# EasyEDA Pro project ProPrj_数控直流电源v3_2025-11-28.epro, schematic v3
Board Name: Board1; Create Date: 2025-11-23; Page Name: P1; Project Name: 数控直流电源v3; Schematic Name: v3; Update Date: 2025-11-23; Company: 嘉立创EDA; Page Size: A4; Version: V1.0
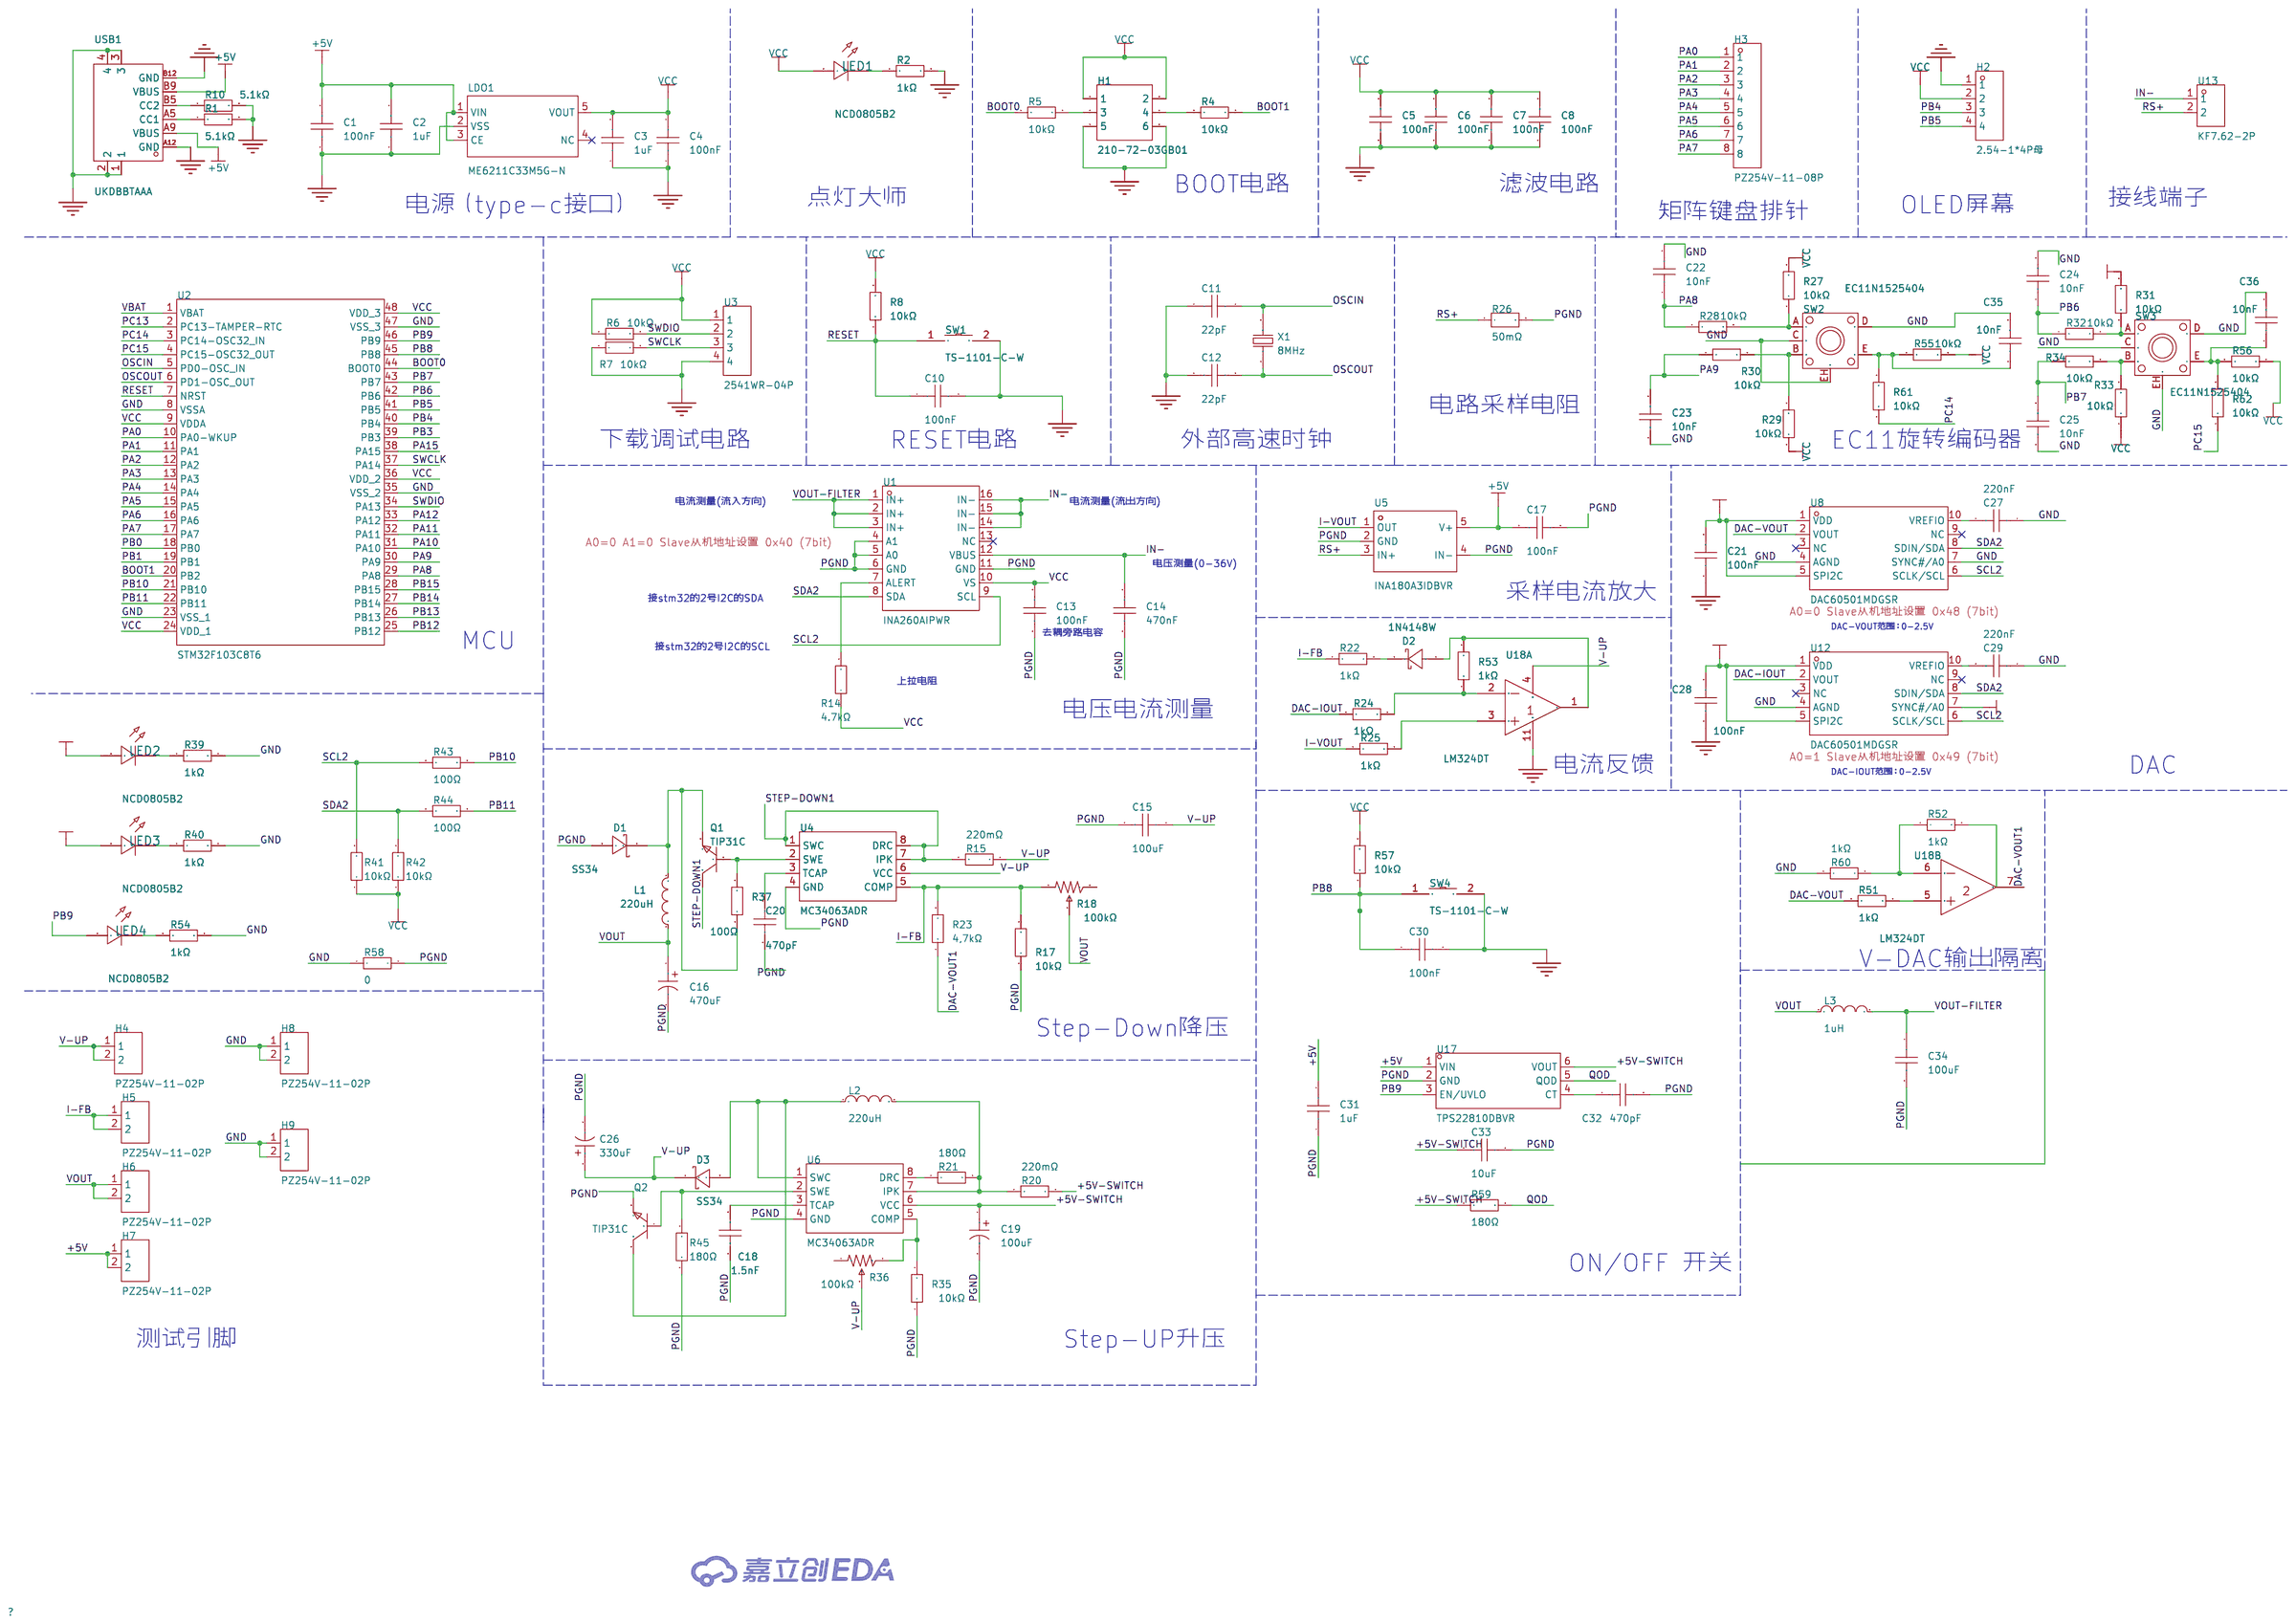
[diagram p0: schematic sheet]

## Parts
C1  100nF  [C0805]
C2  1uF  [C0805]
C3  1uF  [C0805]
C4  100nF  [C0805]
C5  100nF  [C0805]
C6  100nF  [C0805]
C7  100nF  [C0805]
C8  100nF  [C0805]
C10  100nF  [C0805]
C11  22pF  [C0805]
C12  22pF  [C0805]
C13  100nF  [C0805]
C14  470nF  [C0805]
C15  100uF  [CAP-SMD_BD6.3-L6.6-W6.6-RD]
C16  470uF  [CAP-SMD_BD8.0-L8.3-W8.3-LS9.0-FD_H10.5]
C17  100nF  [C0805]
C18  1.5nF  [C0805]
C19  100uF  [CAP-SMD_BD6.3-L6.6-W6.6-RD]
C20  470pF  [C0805]
C21  100nF  [C0805]
C22  10nF  [C0805]
C23  10nF  [C0805]
C24  10nF  [C0805]
C25  10nF  [C0805]
C26  330uF  [CAP-SMD_BD10.0-L10.3-W10.3-FD-LS11.0_H12.0]
C27  220nF  [C0805]
C28  100nF  [C0805]
C29  220nF  [C0805]
C30  100nF  [C0805]
C31  1uF  [C0805]
C32  470pF  [C0805]
C33  10uF  [C0805]
C34  100uF  [CAP-SMD_BD6.3-L6.6-W6.6-RD]
C35  10nF  [C0805]
C36  10nF  [C0805]
D1  SS34  [SMA_L4.3-W2.6-LS5.0-FD]
D2  1N4148W  [SOD-123_L2.7-W1.6-LS3.7-FD]
D3  SS34  [SMA_L4.3-W2.6-LS5.0-FD]
H1  210-72-03GB01  [HDR-TH_6P-P2.54-V-R2-C3-S2.54_A2541WV-2X3P]
H2  2.54-1*4P母  [HDR-TH_4P-P2.54-V-F]
H3  PZ254V-11-08P  [HDR-TH_8P-P2.54-V-M]
H4  PZ254V-11-02P  [HDR-TH_2P-P2.54-V-M]
H5  PZ254V-11-02P  [HDR-TH_2P-P2.54-V-M]
H6  PZ254V-11-02P  [HDR-TH_2P-P2.54-V-M]
H7  PZ254V-11-02P  [HDR-TH_2P-P2.54-V-M]
H8  PZ254V-11-02P  [HDR-TH_2P-P2.54-V-M]
H9  PZ254V-11-02P  [HDR-TH_2P-P2.54-V-M]
L1  220uH  [IND-SMD_L12.3-W12.3_SMDRI127]
L2  220uH  [IND-SMD_L12.3-W12.3_SMDRI127]
L3  1uH  [IND-SMD_L7.0-W6.6]
LDO1  ME6211C33M5G-N  [SOT-23-5_L3.0-W1.7-P0.95-LS2.8-BL]
LED1  NCD0805B2  [LED0805-R-RD]
LED2  NCD0805B2  [LED0805-R-RD]
LED3  NCD0805B2  [LED0805-R-RD]
LED4  NCD0805B2  [LED0805-R-RD]
Q1  TIP31C  [TO-220-3_L10.0-W4.5-P2.54-L]
Q2  TIP31C  [TO-220-3_L10.0-W4.5-P2.54-L]
R1  5.1kΩ  [R0805]
R2  1kΩ  [R0805]
R4  10kΩ  [R0805]
R5  10kΩ  [R0805]
R6  10kΩ  [R0805]
R7  10kΩ  [R0805]
R8  10kΩ  [R0805]
R10  5.1kΩ  [R0805]
R14  4.7kΩ  [R0805]
R15  220mΩ  [R1206]
R17  10kΩ  [R0805]
R18  100kΩ  [RES-ADJ-TH_3296W]
R20  220mΩ  [R1206]
R21  180Ω  [R0805]
R22  1kΩ  [R0805]
R23  4,7kΩ  [R0805]
R24  1kΩ  [R0805]
R25  1kΩ  [R0805]
R26  50mΩ  [R1206]
R27  10kΩ  [R0805]
R28  10kΩ  [R0805]
R29  10kΩ  [R0805]
R30  10kΩ  [R0805]
R31  10kΩ  [R0805]
R32  10kΩ  [R0805]
R33  10kΩ  [R0805]
R34  10kΩ  [R0805]
R35  10kΩ  [R0805]
R36  100kΩ  [RES-ADJ-TH_3296W-1-203]
R37  100Ω  [R0805]
R39  1kΩ  [R0805]
R40  1kΩ  [R0805]
R41  10kΩ  [R0805]
R42  10kΩ  [R0805]
R43  100Ω  [R0805]
R44  100Ω  [R0805]
R45  180Ω  [R0805]
R51  1kΩ  [R0805]
R52  1kΩ  [R0805]
R53  1kΩ  [R0805]
R54  1kΩ  [R0805]
R55  10kΩ  [R0805]
R56  10kΩ  [R0805]
R57  10kΩ  [R0805]
R58  0  [R0805]
R59  180Ω  [R0805]
R60  1kΩ  [R0805]
R61  10kΩ  [R0805]
R62  10kΩ  [R0805]
SW1  TS-1101-C-W  [SW-SMD_L6.0-W3.3-LS8.0]
SW2  EC11N1525404  [SW-TH_EC11NXXXX]
SW3  EC11N1525404  [SW-TH_EC11NXXXX]
SW4  TS-1101-C-W  [SW-SMD_L6.0-W3.3-LS8.0]
U1  INA260AIPWR  [TSSOP-16_L5.0-W4.4-P0.65-LS6.4-BL-1]
U2  STM32F103C8T6  [LQFP-48_L7.0-W7.0-P0.50-LS9.0-BL]
U3  2541WR-04P  [HDR-TH_4P-P2.54-H-M-W10.4-N]
U4  MC34063ADR  [SOIC-8_L4.9-W3.9-P1.27-LS6.0-BL]
U5  INA180A3IDBVR  [SOT-23-5_L3.0-W1.7-P0.95-LS2.8-BR]
U6  MC34063ADR  [SOIC-8_L4.9-W3.9-P1.27-LS6.0-BL]
U8  DAC60501MDGSR  [VSSOP-10_L3.0-W3.0-P0.50-LS4.9-BL]
U12  DAC60501MDGSR  [VSSOP-10_L3.0-W3.0-P0.50-LS4.9-BL]
U13  KF7.62-2P  [CONN-TH_KF7.62-2P]
U17  TPS22810DBVR  [SOT-23-6_L2.9-W1.6-P0.95-LS2.8-BL]
U18  LM324DT  [SOIC-14_L8.7-W3.9-P1.27-LS6.0-BL]  (sections 1,2)
USB1  UKDBBTAAA  [USB-C-SMD]
X1  8MHz  [CRYSTAL-TH_L11.1-W4.7-P4.88]

## Library data of the parts
C1 C4-C8 C10 C13 C17 C21 C28 C30 = 0805B104K500NT: 容值:100nF;精度:±10%;额定电压:50V;温度系数:X7R;; LCSC Part Name: 100nF ±10% 50V; Supplier Part: C38141; Manufacturer: FH(风华); Supplier Footprint: 0805; JLCPCB Part Class: Extended Part; Datasheet: https://item.szlcsc.com/datasheet/0805B104K500NT/39123.html; Supplier: LCSC; Tolerance: ±10%; Voltage Rating: 50V; Temperature Coefficient: X7R
C2 C3 C31 = CL21B105KBFNNNE: 容值:1uF;精度:±10%;额定电压:50V;温度系数:X7R;; LCSC Part Name: 1uF ±10% 50V; Supplier Part: C28323; Manufacturer: SAMSUNG(三星); Supplier Footprint: 0805; JLCPCB Part Class: Basic Part; Datasheet: https://item.szlcsc.com/datasheet/CL21B105KBFNNNE/29074.html; Supplier: LCSC; Tolerance: ±10%; Voltage Rating: 50V; Temperature Coefficient: X7R
C11 C12 = 0805CG220J500NT: 容值:22pF;精度:±5%;额定电压:50V;温度系数:C0G;; LCSC Part Name: 22pF ±5% 50V; Supplier Part: C24658; Manufacturer: FH(风华); Supplier Footprint: 0805; JLCPCB Part Class: Extended Part; Datasheet: https://item.szlcsc.com/datasheet/0805CG220J500NT/25399.html; Supplier: LCSC; Tolerance: ±5%; Voltage Rating: 50V; Temperature Coefficient: C0G
C14 = 0805B474K500NT: 容值:470nF;精度:±10%;额定电压:50V;温度系数:X7R;; LCSC Part Name: 470nF ±10% 50V; Supplier Part: C49955; Manufacturer: FH(风华); Supplier Footprint: 0805; JLCPCB Part Class: Extended Part; Datasheet: https://item.szlcsc.com/datasheet/0805B474K500NT/50964.html; Supplier: LCSC; Tolerance: ±10%; Voltage Rating: 50V; Temperature Coefficient: X7R
C15 C19 C34 = MA35V100M6X8: 容值:100uF;精度:±20%;额定电压:35V;纹波电流:2.9A@100kHz;等效串联电阻(ESR):30mΩ@100kHz;类型:聚合物;; LCSC Part Name: 100uF ±20% 35V; Supplier Part: C46550467; Manufacturer: JIERR(捷而瑞); Supplier Footprint: SMD,D6.3xL7.7mm; JLCPCB Part Class: Extended Part; Datasheet: https://item.szlcsc.com/datasheet/MA35V100M6X8/48680161.html; Supplier: LCSC; Tolerance: ±20%; Voltage Rating: 35V; Ripple Current: 2.9A@100kHz; Equivalent Series Resistance(ESR): 30mΩ@100kHz; Type: 聚合物; Diameter: 6.3mm; Height - Seated (Max): 7mm; Lifetime: 2000hrs@105℃; Operating Temperature: -55℃~+105℃
C16 = MA25V470M8x10: 容值:470uF;精度:±20%;额定电压:25V;纹波电流:4.1A@100kHz;等效串联电阻(ESR):25mΩ@100kHz;类型:聚合物;; LCSC Part Name: 470uF ±20% 25V; Supplier Part: C46550466; Manufacturer: JIERR(捷而瑞); Supplier Footprint: SMD,D8xL10mm; JLCPCB Part Class: Extended Part; Datasheet: https://item.szlcsc.com/datasheet/MA25V470M8x10/48680160.html; Supplier: LCSC; Tolerance: ±20%; Voltage Rating: 25V; Ripple Current: 4.1A@100kHz; Equivalent Series Resistance(ESR): 25mΩ@100kHz; Type: 聚合物; Diameter: 8mm; Height - Seated (Max): 10mm; Lifetime: 2000hrs@105℃; Operating Temperature: -55℃~+105℃
C18 = 0805B152K500NT: 容值:1.5nF;精度:±10%;额定电压:50V;温度系数:X7R;; LCSC Part Name: 1.5nF ±10% 50V; Supplier Part: C1717; Manufacturer: FH(风华); Supplier Footprint: 0805; JLCPCB Part Class: Extended Part; Datasheet: https://atta.szlcsc.com/upload/public/pdf/source/20200305/C486355_26A10D38EF8C2A5C37091D0039909270.pdf; Supplier: LCSC; Tolerance: ±10%; Voltage Rating: 50V; Temperature Coefficient: X7R
C20 C32 = 0805B471K500NT: 容值:470pF;精度:±10%;额定电压:50V;温度系数:X7R;; LCSC Part Name: 470pF ±10% 50V; Supplier Part: C1743; Manufacturer: FH(风华); Supplier Footprint: 0805; JLCPCB Part Class: Basic Part; Datasheet: https://item.szlcsc.com/datasheet/0805B471K500NT/2095.html; Supplier: LCSC; Tolerance: ±10%; Voltage Rating: 50V; Temperature Coefficient: X7R
C22-C25 C35 C36 = 0805B103K500NT_C52278: 容值:10nF;精度:±10%;额定电压:50V;材质(温度系数):X7R;; LCSC Part Name: 10nF ±10% 50V; Supplier Part: C52278; Manufacturer: FH(风华); Manufacturer Part: 0805B103K500NT; Supplier Footprint: 0805; JLCPCB Part Class: Extended Part; Datasheet: https://atta.szlcsc.com/upload/public/pdf/source/20200305/C486355_26A10D38EF8C2A5C37091D0039909270.pdf; Supplier: LCSC; Tolerance: ±10%; Voltage Rated: 50V; Temperature Coefficient: X7R
C26 = MA35V330M10x10: 容值:330uF;精度:±20%;额定电压:35V;纹波电流:3.5A@100kHz;等效串联电阻(ESR):25mΩ@100kHz;类型:聚合物;; LCSC Part Name: 330uF ±20% 35V; Supplier Part: C46550470; Manufacturer: JIERR(捷而瑞); Supplier Footprint: SMD,D10xL10mm; JLCPCB Part Class: Extended Part; Datasheet: https://item.szlcsc.com/datasheet/MA35V330M10x10/48680164.html; Supplier: LCSC; Tolerance: ±20%; Voltage Rating: 35V; Ripple Current: 3.5A@100kHz; Equivalent Series Resistance(ESR): 25mΩ@100kHz; Type: 聚合物; Diameter: 10mm; Height - Seated (Max): 10mm; Lifetime: 2000hrs@105℃; Operating Temperature: -55℃~+105℃
C27 C29 = 0805B224K500NT: 容值:220nF;精度:±10%;额定电压:50V;温度系数:X7R;; LCSC Part Name: 220nF ±10% 50V; Supplier Part: C163697; Manufacturer: FH(风华); Supplier Footprint: 0805; JLCPCB Part Class: Extended Part; Datasheet: https://atta.szlcsc.com/upload/public/pdf/source/20200305/C486355_26A10D38EF8C2A5C37091D0039909270.pdf; Supplier: LCSC; Tolerance: ±10%; Voltage Rating: 50V; Temperature Coefficient: X7R
C33 = CL21A106KAYNNNE_C15850: 容值:10uF;精度:±10%;额定电压:25V;温度系数:X5R;; LCSC Part Name: 10uF ±10% 25V; Supplier Part: C15850; Manufacturer: SAMSUNG(三星); Manufacturer Part: CL21A106KAYNNNE; Supplier Footprint: 0805; JLCPCB Part Class: Basic Part; Datasheet: https://item.szlcsc.com/datasheet/CL21A106KAYNNNE/16532.html; Supplier: LCSC; Tolerance: ±10%; Voltage Rating: 25V; Temperature Coefficient: X5R
D1 D3 = SS34_C7420365: 二极管配置:独立式;正向压降(Vf):550mV@3.0A;直流反向耐压(Vr):40V;整流电流:3A;; LCSC Part Name: 电压:40V 电流:3A; Supplier Part: C7420365; Manufacturer: R+O(宏嘉诚); Supplier Footprint: SMA(DO-214AC); JLCPCB Part Class: Extended Part; Datasheet: https://item.szlcsc.com/datasheet/SS34/8397187.html; Supplier: LCSC; Diode Configuration: 独立式; Voltage - Forward(Vf@If): 550mV@3.0A; Voltage - DC Reverse(Vr): 40V; Current - Rectified: 3A; Reverse Leakage Current (Ir): 200uA@40V
D2 = 1N4148W_C7420318: 二极管配置:独立式;正向压降(Vf):1.25V@150mA;直流反向耐压(Vr):100V;整流电流:150mA;反向恢复时间(Trr):4ns;; Supplier Part: C7420318; Manufacturer: R+O(宏嘉诚); Supplier Footprint: SOD-123; JLCPCB Part Class: 扩展库; Datasheet: https://item.szlcsc.com/datasheet/1N4148W/8397140.html; Supplier: LCSC; Diode Configuration: 独立式; Voltage - Forward(Vf@If): 1.25V@150mA; Voltage - DC Reverse(Vr): 100V; Current - Rectified: 150mA; Pd - Power Dissipation: 400mW; Reverse Leakage Current (Ir): 1uA@75V; Reverse Recovery Time (trr): 4ns; Operating Junction Temperature Range: -55℃~+150℃; Non-Repetitive Peak Forward Surge Current: 2A
H1 = 210-72-03GB01: 插针结构:2x3P;间距:2.54mm;行距:2.54mm;圆针/方针:方针;安装方式:直插;排数:双排;总PIN位数:6P;额定电流:-;额定电压:-;配合针长度:6.1mm;塑高:2.5mm;端接针长度:3mm;触头材质:黄铜;触头镀层:-;工作温度:-40℃~+105℃;颜色:黑色;; LCSC Part Name: 2x3P 间距:2.54mm 方针 直插; Supplier Part: C402781; Manufacturer: PINREX(频锐科技); Supplier Footprint: 插件,P=2.54mm; JLCPCB Part Class: Extended Part; Datasheet: https://item.szlcsc.com/datasheet/210-72-03GB01/388222.html; Supplier: LCSC; Pin Structure: 2x3P; Pitch: 2.54mm; Row Spacing: 2.54mm; Circluar Pins/Square Pins: 方针; Mounting Type: 直插; Number of Rows: 双排; Number of Pins: 6P; Length of Mating Pin: 6.1mm; Insulation Height: 2.5mm; Length of End Connection Pin: 3mm; Contact Material: 黄铜; Operating Temperature: -40℃~+105℃; Color: 黑色
H2 = 2.54-1*4P母: 插孔结构:1x4P;间距:2.54mm;行距:-;圆孔/方孔:方孔;安装方式:直插;排数:单排;总孔位数:4P;额定电流:3A;额定电压:-;插孔方向:顶部;塑高:-;触头材质:青铜;触头镀层:-;工作温度:-40℃~+105℃;; LCSC Part Name: 间距:2.54mm 1x4P 直插; Supplier Part: C2718488; Manufacturer: BOOMELE(博穆精密); Supplier Footprint: 插件,P=2.54mm; JLCPCB Part Class: 扩展库; Datasheet: https://item.szlcsc.com/datasheet/2.54-1*4P%25E6%25AF%258D/2834502.html; Supplier: LCSC; Holes Structure: 1x4P; Pitch: 2.54mm; Circular Hole / Square Hole: 方孔; Mounting Type: 直插; Number of Rows: 单排; Number of Positions: 4P; Current Rating: 3A; Holes Direction: 顶部; Contact Material: 青铜; Operating Temperature: -40℃~+105℃
H3 = PZ254V-11-08P: 插针结构:1x8P;间距:2.54mm;行距:-;圆针/方针:方针;安装方式:直插;排数:单排;总PIN位数:8P;额定电流:-;额定电压:-;配合针长度:6mm;塑高:2.5mm;端接针长度:3mm;触头材质:黄铜;触头镀层:-;工作温度:-40℃~+105℃;颜色:黑色;; LCSC Part Name: 1x8P 间距:2.54mm 方针 直插; Supplier Part: C492407; Manufacturer: XFCN(兴飞); Supplier Footprint: 插件,P=2.54mm; JLCPCB Part Class: 扩展库; Datasheet: https://item.szlcsc.com/datasheet/PZ254V-11-08P/502963.html; Supplier: LCSC; Pin Structure: 1x8P; Pitch: 2.54mm; Circluar Pins/Square Pins: 方针; Mounting Type: 直插; Number of Rows: 单排; Number of Pins: 8P; Length of Mating Pin: 6mm; Insulation Height: 2.5mm; Length of End Connection Pin: 3mm; Contact Material: 黄铜; Operating Temperature: -40℃~+105℃; Color: 黑色
H4-H9 = PZ254V-11-02P: 插针结构:1x2P;间距:2.54mm;行距:-;圆针/方针:方针;安装方式:直插;排数:单排;总PIN位数:2P;额定电流:-;额定电压:-;配合针长度:6mm;塑高:2.5mm;端接针长度:3mm;触头材质:黄铜;触头镀层:-;工作温度:-40℃~+105℃;颜色:黑色;; LCSC Part Name: 1x2P 间距:2.54mm 方针 直插; Supplier Part: C492401; Manufacturer: XFCN(兴飞); Supplier Footprint: 插件,P=2.54mm; JLCPCB Part Class: 扩展库; Datasheet: https://item.szlcsc.com/datasheet/PZ254V-11-02P/502957.html; Supplier: LCSC; Pin Structure: 1x2P; Pitch: 2.54mm; Circluar Pins/Square Pins: 方针; Mounting Type: 直插; Number of Rows: 单排; Number of Pins: 2P; Length of Mating Pin: 6mm; Insulation Height: 2.5mm; Length of End Connection Pin: 3mm; Contact Material: 黄铜; Operating Temperature: -40℃~+105℃; Color: 黑色
L1 L2 = SMDRI127-221MT: 电感值:220uH;精度:±20%;额定电流:1.16A;饱和电流(Isat):2A;类型:屏蔽电感;; LCSC Part Name: 220uH ±20% 2A; Supplier Part: C10151; Manufacturer: SXN(顺翔诺); Supplier Footprint: SMD,12.3x12.3mm; JLCPCB Part Class: Extended Part; Datasheet: https://atta.szlcsc.com/upload/public/pdf/source/20210810/6F96FDC19AA308DD2AD166FFB9640E87.pdf; Supplier: LCSC; Tolerance: ±20%; Rated Current: 1.16A; Saturation Current (Isat): 2A; DC Resistance (DCR): 390mΩ; Type: 屏蔽电感
L3 = FXL0630-1R0-M: 电感值:1uH;精度:±20%;额定电流:12A;饱和电流(Isat):15A;类型:一体成型电感;; LCSC Part Name: 1uH ±20% 15A; Supplier Part: C167216; Manufacturer: cjiang(长江微电); Supplier Footprint: SMD,7x6.6mm; JLCPCB Part Class: Extended Part; Datasheet: https://item.szlcsc.com/datasheet/FXL0630-1R0-M/178599.html; Supplier: LCSC; Tolerance: ±20%; Current Rating: 12A; Current - Saturation(Isat): 15A; DC Resistance(DCR): 7.4mΩ; Type: 一体成型电感
LDO1 = ME6211C33M5G-N: 输出类型:固定;工作电压:6V;输出电压:3.3V;输出电流:500mA;电源纹波抑制比(PSRR):70dB@(1kHz);输出极性:正极;; LCSC Part Name: 输入6V 输出3.3V 500mA; Supplier Part: C82942; Manufacturer: MICRONE(南京微盟); Supplier Footprint: SOT-23-5; JLCPCB Part Class: Extended Part; Datasheet: https://atta.szlcsc.com/upload/public/pdf/source/20170918/C82942_1505727073070976520.pdf; Supplier: LCSC; Output Type: 固定; Voltage - Supply: 6V; Output Voltage: 3.3V; Output Current: 500mA; Power Supply Rejection Ratio (PSRR): 70dB@(1kHz); Voltage Dropout: 120mV@(100mA); standby current: 60uA; Noise: 50uVrms; Features: 过流保护；带使能；短路保护; Operating Temperature: -40℃~+150℃; Output Configuration: 正极; Number of Outputs: 1
LED1-LED4 = NCD0805B2: 发光颜色:蓝色;正向电压(VF):2.5V~3.6V;功率:72mW;正向电流:2mA;主波长:468nm~478nm;透镜颜色:无色透明透镜;发光强度:20mcd~55mcd;发光角度:130°;工作温度:-30℃~+85℃;; Supplier Part: C84259; Manufacturer: 国星光电; Supplier Footprint: 0805; JLCPCB Part Class: Extended Part; Datasheet: https://atta.szlcsc.com/upload/public/pdf/source/20200820/C84259_E5AC6865415989C4C2C2831134BA3A23.pdf; Supplier: LCSC; Emitted Color: 蓝色; Forward Voltage (VF): 2.5V~3.6V; Power Dissipation: 72mW; Forward Current: 2mA; Dominant Wavelength: 468nm~478nm; Lens Color: 无色透明透镜; Luminous Intensity: 20mcd~55mcd; Viewing Angle: 130°; Operating Temperature: -30℃~+85℃
Q1 Q2 = TIP31C_C963401: 晶体管类型:NPN;集电极电流(Ic):3A;集射极击穿电压(Vceo):100V;耗散功率(Pd):40W;直流电流增益(hFE):50@3A,4V;; LCSC Part Name: NPN 电流:3A 电压:100V; Supplier Part: C963401; Manufacturer: JSMSEMI(杰盛微); Supplier Footprint: TO-220; JLCPCB Part Class: 扩展库; Datasheet: https://item.szlcsc.com/datasheet/TIP31C/1047112.html; Supplier: LCSC; type: NPN; Current - Collector(Ic): 3A; Collector - Emitter Voltage VCEO: 100V; Pd - Power Dissipation: 40W; DC Current Gain: 50@3A,4V; Transition frequency(fT): 3MHz; Current - Collector Cutoff: 200uA; Vce Saturation(VCE(sat)): 1.2V; Emitter-Base Voltage(Vebo): 5V
R1 R10 = 0805W8F5101T5E: 电阻类型:厚膜电阻;阻值:5.1kΩ;精度:±1%;功率:125mW;工作电压:150V;温度系数:±100ppm/℃;; LCSC Part Name: 5.1kΩ ±1% 125mW 厚膜电阻; Supplier Part: C27834; Manufacturer: UNI-ROYAL(厚声); Supplier Footprint: 0805; JLCPCB Part Class: Basic Part; Datasheet: https://item.szlcsc.com/datasheet/0805W8F5101T5E/28584.html; Supplier: LCSC; Type: 厚膜电阻; Tolerance: ±1%; Power(Watts): 125mW; Voltage-Supply(Max): 150V; Temperature Coefficient: ±100ppm/℃; Operating Temperature: -55℃~+155℃
R2 R22 R24 R25 R39 R40 R51-R54 R60 = 0805W8F1001T5E: 电阻类型:厚膜电阻;阻值:1kΩ;精度:±1%;功率:125mW;最大工作电压:150V;温度系数:±100ppm/℃;; LCSC Part Name: 1kΩ ±1% 125mW 厚膜电阻; Supplier Part: C17513; Manufacturer: UNI-ROYAL(厚声); Supplier Footprint: 0805; JLCPCB Part Class: Basic Part; Datasheet: https://atta.szlcsc.com/upload/public/pdf/source/20200306/C422600_1E6D84923E4A46A82E41ADD87F860B5C.pdf; Supplier: LCSC; Type: 厚膜电阻; Tolerance: ±1%; Power(Watts): 125mW; Overload Voltage (Max): 150V; Temperature Coefficient: ±100ppm/℃; Operating Temperature Range: -55℃~+155℃
R4-R8 R17 R23 R27-R35 R41 R42 R55-R57 R61 R62 = 0805W8F1002T5E_C17414: 电阻类型:厚膜电阻;阻值:10kΩ;精度:±1%;功率:125mW;工作电压:150V;温度系数:±100ppm/℃;; LCSC Part Name: 10kΩ ±1% 125mW 厚膜电阻; Supplier Part: C17414; Manufacturer: UNI-ROYAL(厚声); Manufacturer Part: 0805W8F1002T5E; Supplier Footprint: 0805; JLCPCB Part Class: Basic Part; Datasheet: https://item.szlcsc.com/datasheet/0805W8F1002T5E/18102.html; Supplier: LCSC; Type: 厚膜电阻; Tolerance: ±1%; Power(Watts): 125mW; Voltage-Supply(Max): 150V; Temperature Coefficient: ±100ppm/℃; Operating Temperature: -55℃~+155℃
R14 = 0805W8F4701T5E: 电阻类型:厚膜电阻;阻值:4.7kΩ;精度:±1%;功率:125mW;最大工作电压:150V;温度系数:±100ppm/℃;; LCSC Part Name: 4.7kΩ ±1% 125mW 厚膜电阻; Supplier Part: C17673; Manufacturer: UNI-ROYAL(厚声); Supplier Footprint: 0805; JLCPCB Part Class: Basic Part; Datasheet: https://atta.szlcsc.com/upload/public/pdf/source/20200306/C422600_1E6D84923E4A46A82E41ADD87F860B5C.pdf; Supplier: LCSC; Type: 厚膜电阻; Tolerance: ±1%; Power(Watts): 125mW; Overload Voltage (Max): 150V; Temperature Coefficient: ±100ppm/℃; Operating Temperature Range: -55℃~+155℃
R15 R20 = FRL1206FR220TS: 电阻类型:厚膜电阻;阻值:220mΩ;精度:±1%;功率:250mW;工作电压:500V;温度系数:±300ppm/℃;; LCSC Part Name: 220mΩ ±1% 250mW 厚膜电阻; Supplier Part: C2907349; Manufacturer: FOJAN(富捷); Supplier Footprint: 1206; JLCPCB Part Class: Extended Part; Supplier: LCSC; Type: 厚膜电阻; Tolerance: ±1%; Power(Watts): 250mW; Voltage-Supply(Max): 500V; Temperature Coefficient: ±300ppm/℃; Operating Temperature: -55℃~+155℃
R18 = 3296W-1-104LF: 阻值:100kΩ;精度:±10%;功率:500mW;温度系数:±100ppm/℃;; LCSC Part Name: 100kΩ ±10%; Supplier Part: C48084; Manufacturer: BOURNS; Supplier Footprint: SIP-3P,9.5x4.8mm; JLCPCB Part Class: Extended Part; Datasheet: https://item.szlcsc.com/datasheet/3296W-1-104LF/49091.html; Supplier: LCSC; Tolerance: ±10%; Power(Watts): 500mW; Temperature Coefficient: ±100ppm/℃; Number of Turns: 25
R21 R45 R59 = 0805W8F1800T5E: 电阻类型:厚膜电阻;阻值:180Ω;精度:±1%;功率:125mW;工作电压:150V;温度系数:±100ppm/℃;; LCSC Part Name: 180Ω ±1% 125mW 厚膜电阻; Supplier Part: C25270; Manufacturer: UNI-ROYAL(厚声); Supplier Footprint: 0805; JLCPCB Part Class: Extended Part; Datasheet: https://item.szlcsc.com/datasheet/0805W8F1800T5E/26013.html; Supplier: LCSC; Type: 厚膜电阻; Tolerance: ±1%; Power(Watts): 125mW; Voltage-Supply(Max): 150V; Temperature Coefficient: ±100ppm/℃; Operating Temperature: -55℃~+155℃
R26 = RE1206F1R050: 电阻类型:采样电阻；合金电阻;阻值:50mΩ;精度:±1%;功率:1W;温度系数:±50ppm/℃;; LCSC Part Name: 50mΩ 1W 1206 ±1%; Supplier Part: C46961736; Manufacturer: JIERR(捷而瑞); Supplier Footprint: 1206; JLCPCB Part Class: 扩展库; Datasheet: https://item.szlcsc.com/datasheet/RE1206F1R050/49133275.html; Supplier: LCSC; Type: 采样电阻；合金电阻; Tolerance: ±1%; Power(Watts): 1W; Temperature Coefficient: ±50ppm/℃
R36 = 3296W-1-104_C48997936: 阻值:100kΩ;精度:±10%;功率:500mW;温度系数:±250ppm/℃;; LCSC Part Name: 3296W-1-104; Supplier Part: C48997936; Manufacturer: JIERR(捷而瑞); Manufacturer Part: 3296W-1-104; Supplier Footprint: 插件-3P,9.5x4.9mm; JLCPCB Part Class: Extended Part; Datasheet: https://item.szlcsc.com/datasheet/3296W-1-104/51342072.html; Supplier: LCSC; Tolerance: ±10%; Power(Watts): 500mW; Temperature Coefficient: ±250ppm/℃; Number of Turns: 28
R37 R43 R44 = 0805W8F1000T5E: 电阻类型:厚膜电阻;阻值:100Ω;精度:±1%;功率:125mW;最大工作电压:150V;温度系数:±100ppm/℃;; LCSC Part Name: 100Ω ±1% 125mW 厚膜电阻; Supplier Part: C17408; Manufacturer: UNI-ROYAL(厚声); Supplier Footprint: 0805; JLCPCB Part Class: Basic Part; Datasheet: https://atta.szlcsc.com/upload/public/pdf/source/20200306/C422600_1E6D84923E4A46A82E41ADD87F860B5C.pdf; Supplier: LCSC; Type: 厚膜电阻; Tolerance: ±1%; Power(Watts): 125mW; Overload Voltage (Max): 150V; Temperature Coefficient: ±100ppm/℃; Operating Temperature Range: -55℃~+155℃
R58 = Res_0805: Supplier Footprint: 0805
SW1 SW4 = TS-1101-C-W: 电路结构:单刀单掷;按钮形状:矩形按钮;作用力:260gf;安装方式:立贴;开关长度:6mm;开关宽度:3.6mm;开关高度:2.5mm;带支架:不带;触点电流:50mA;额定电压(AC):-;额定电压(DC):12V;额定功率:-;绝缘电阻:-;带灯:无;机械寿命:5万次;; LCSC Part Name: 6*3.6*2.5mm 立贴 轻触开关; Supplier Part: C318938; Manufacturer: XKB Connectivity(中国星坤); Supplier Footprint: SMD; JLCPCB Part Class: 扩展库; Datasheet: https://atta.szlcsc.com/upload/public/pdf/source/20200227/C318938_C2E53B1EEDE37D980A33616AC086DE53.pdf; Supplier: LCSC; Circuit: 单刀单掷; Actuator Style: 矩形按钮; Operating Force: 260gf; Mounting Style: 立贴; Switch Length: 6mm; Switch Width: 3.6mm; Switch Height: 2.5mm; Strike Gundam: 不带; Contact Current: 50mA; Voltage Rating (DC): 12V; Actuator/Cap Color: 白色带淡绿; With Lamp: 无; Mechanical Life: 5万次; Operating Temperature: -30℃~+85℃
SW2 SW3 = EC11N1525404: Supplier Part: C470748; Manufacturer: ALPSALPINE(阿尔卑斯阿尔派); Supplier Footprint: 插件; JLCPCB Part Class: 扩展库; Datasheet: https://atta.szlcsc.com/upload/public/pdf/source/20191216/C470795_DE763ECE59BD49533DB26DB53E5D34B2.pdf; Supplier: LCSC
U1 = INA260AIPWR: INA260 具有集成分流电阻的 36V、16 位、精密 I2C 输出电流/电压/功率监控器; LCSC Part Name: 具有低漂移、高精度集成分流器的精密电流和功率监测计; Supplier Part: C2155885; Manufacturer: TI(德州仪器); Supplier Footprint: TSSOP-16; JLCPCB Part Class: 扩展库; Datasheet: https://www.ti.com/cn/lit/gpn/ina260; Supplier: LCSC
U2 = STM32F103C8T6: CPU内核:ARM-M3;CPU最大主频:72MHz;应用领域:-;; LCSC Part Name: 主流增强型ARM Cortex-M3 MCU，具有64 KB Flash、72 MHz CPU、电机控制、USB和CAN; Supplier Part: C8734; Manufacturer: ST(意法半导体); Supplier Footprint: LQFP-48(7x7); JLCPCB Part Class: 扩展库; Datasheet: https://item.szlcsc.com/datasheet/STM32F103C8T6/9243.html; Supplier: LCSC; CPU Core: ARM-M3; CPU Maximum Speed: 72MHz; Program Storage Size: 64KB; Program Memory Type: FLASH; Number of I/O: 37; ADC (Bit): 12bit; Voltage - Supply: 2V~3.6V
U3 = 2541WR-04P: 插针结构:1x4P;间距:2.54mm;圆针/方针:方针;安装方式:弯插;排数:单排;总PIN位数:4P;配合针长度:6mm;塑高:2.54mm;触头镀层:金;工作温度:-40℃~+105℃;; LCSC Part Name: 1x4P 间距:2.54mm 方针 弯插; Supplier Part: C5383097; Manufacturer: HanElectricity(瀚源); Supplier Footprint: 弯插,P=2.54mm; JLCPCB Part Class: 扩展库; Datasheet: https://item.szlcsc.com/datasheet/2541WR-04P/6258457.html; Supplier: LCSC; Pin Structure: 1x4P; Pitch: 2.54mm; Circluar Pins/Square Pins: 方针; Mounting Type: 弯插; Number of Rows: 单排; Number of Pins: 4P; Length of Mating Pin: 6mm; Insulation Height: 2.54mm; Contact Plating: 金; Operating Temperature: -40℃~+105℃
U4 U6 = MC34063ADR: 功能类型:升压型；降压型;工作电压:3V~40V;输出电压:-;输出电流:1.5A;输出类型:可调;; LCSC Part Name: 1.5A 峰值，升压/降压/反相开关稳压器; Supplier Part: C100023; Manufacturer: TI(德州仪器); Supplier Footprint: SOIC-8; JLCPCB Part Class: 扩展库; Datasheet: https://www.ti.com/cn/lit/gpn/mc33063a; Supplier: LCSC; Function: 升压型；降压型; Voltage - Supply: 3V~40V; Output Current: 1.5A; Frequency - Switching: 100kHz; Operating Temperature: 0℃~+70℃@(TA); Synchronous Rectifier: 否; Number of Outputs: 1; Topology: 降压式；升压式；反相式; Switch tube (built-in/external): 内置; Output Type: 可调
U5 = INA180A3IDBVR: 放大器数:单路;共模电压:-200mV~26V;增益:100V/V;带宽:150kHz;; Supplier Part: C122882; Manufacturer: TI(德州仪器); Supplier Footprint: SOT-23-5; JLCPCB Part Class: 扩展库; Datasheet: https://www.ti.com/cn/lit/gpn/ina180; Supplier: LCSC; Number of Channels: 单路; Vcm - Common Mode Voltage: -200mV~26V; Gain: 100V/V; Bandwidth: 150kHz; Voltage - Supply: 2.7V~5.5V; Operating Temperature: -40℃~+125℃
U8 U12 = DAC60501MDGSR: 分辨率:12位;接口类型:SPI；I2C;工作电压:2.7V~5.5V;稳定时间:5us;积分非线性:1LSB;; LCSC Part Name: 具有精密内部基准的DACx0501位电压输出DAC; Supplier Part: C1852028; Manufacturer: TI(德州仪器); Supplier Footprint: VSSOP-10-0.5mm; JLCPCB Part Class: 扩展库; Datasheet: https://www.ti.com/cn/lit/gpn/dac60501; Supplier: LCSC; Resolution(Bits): 12位; Number of Channels: 1; Interface: SPI；I2C; Voltage - Supply: 2.7V~5.5V; Settling Time: 5us; Output Type: 电压-缓冲; Integral non - linearity: 1LSB; Operating Temperature: -40℃~+125℃; Power-On Reset: 内置; Voltage Reference: 内置; Voltage Reference Drift: 5ppm/℃; Data rate: 1MHz；50MHz；100kHz；400kHz; Supply Current (Iq): 15uA
U13 = KF7.62-2P: 隔板类型:两面;间距:7.62mm;结构:1x2P;安装方式:直针;引脚位置:边脚;排数:1;额定电流:24A;额定电压:450V;线规 - AWG:12~22;线规 - 平方毫米:2.5;工作温度范围:-40℃~+105℃;颜色:黑色;每排PIN数:2;; LCSC Part Name: 7.62mm 1x2P 每排P数:2 排数:1 直针 边脚 黑色; Supplier Part: C707824; Manufacturer: KEFA(科发); Supplier Footprint: 插件,P=7.62mm; JLCPCB Part Class: 扩展库; Datasheet: https://atta.szlcsc.com/upload/public/pdf/source/20230331/11104CA872B730518BFDFC9F574D6E42.pdf; Supplier: LCSC; Barrier Type: 两面; Pitch: 7.62mm; Structure: 1x2P; Mounting Style: 直针; Pin Location: 边脚; Number of Pins: 2P; Number of Rows: 1; Current Rating (Max): 24A; Voltage Rating (Max): 450V; Wire Gauge - AWG: 12~22; Wire Gauge - mm2: 2.5; Operating Temperature Range: -40℃~+105℃; Color: 黑色; Number of PINs Per Row: 2
U17 = TPS22810DBVR: 类型:负载开关;通道数:1;输入控制逻辑:高电平有效;最大连续电流:2A;工作电压:2.7V~18V;导通电阻:79mΩ;; LCSC Part Name: 具备热保护功能，工作电压2.7-18 V、导通电阻79 mΩ的负载开关; Supplier Part: C205990; Manufacturer: TI(德州仪器); Supplier Footprint: SOT-23-6; JLCPCB Part Class: 扩展库; Datasheet: https://www.ti.com/cn/lit/gpn/tps22810; Supplier: LCSC; Type: 负载开关; Number of Channels: 1; Control Input Logic: 高电平有效; Maximum Continuous Current: 2A; Voltage - Supply: 2.7V~18V; RDS(on): 79mΩ; Operating Temperature	-: -40℃~+105℃; Features: 过热保护(OTP)；欠压保护(UVP)
U18 = LM324DT: 放大器数:四路;轨到轨:-;增益带宽积(GBP):1.3MHz;输入失调电压(Vos):5mV;压摆率(SR):20V/us;输入偏置电流(Ib):300nA;; LCSC Part Name: 低功耗四路运算放大器; Supplier Part: C71035; Manufacturer: ST(意法半导体); Supplier Footprint: SOIC-14; JLCPCB Part Class: Basic Part; Datasheet: https://item.szlcsc.com/datasheet/LM324DT/72134.html; Supplier: LCSC; Number of Channels: 四路; Maximum Power Supply Range (Vdd-Vss): 30V; Gain Bandwidth Product: 1.3MHz; Vos - Input Offset Voltage: 5mV; Input Offset Voltage Drift(Vos TC): 30uV/℃; Slew Rate: 20V/us; Ib - Input Bias Current: 300nA; Input Offset Current(Ios): 20nA; Noise density(eN): 40nV/√Hz@1kHz; Common Mode Rejection Ratio(CMRR): 80dB; Input offset current drift(Ios TC): 200pA/℃; Quiescent Current: 1.2mA; Output Current: 70mA; Operating Temperature: 0℃~+70℃; Single supply: 3V~30V; Dual Supply: -15V~-1.5V；1.5V~15V
USB1 = UKDBBTAAA: 连接器类型:Type-C;协议标准:USB 3.1;公母:母;安装方式:卧贴;触点数量:6P;端口数量:1;额定电流 - 电源:3A;工作温度:-25℃~+85℃;; LCSC Part Name: Type-C 母 卧贴; Supplier Part: C29780875; Manufacturer: SAMZO(三佐); Supplier Footprint: SMD; JLCPCB Part Class: 扩展库; Datasheet: https://item.szlcsc.com/datasheet/UKDBBTAAA/31512988.html; Supplier: LCSC; Connector Type: Type-C; Protocol Standard: USB 3.1; Gender: 母; Mounting Type: 卧贴; Number of Contacts: 6P; Number of Ports: 1; Current Rating-Power: 3A; Voltage Rating: 5V; Connect-Disconnect Life: 3千次; Length: 6.8mm; Detection color: 黑色; Operating Temperature: -25℃~+85℃
X1 = YG8MLBBE2X: 晶振类型:直插晶振;频率:8MHz;常温频差:±10ppm;负载电容:20pF;频率稳定度:±30ppm;; LCSC Part Name: 49S 8M 20PF 10PPM; Supplier Part: C42441034; Manufacturer: YJX(雅晶鑫); Supplier Footprint: HC-49S; JLCPCB Part Class: 扩展库; Datasheet: https://item.szlcsc.com/datasheet/YG8MLBBE2X/44488494.html; Supplier: LCSC; Type: 直插晶振; Normal temperature Frequency Tolerance: ±10ppm; Load Capacitance: 20pF; Frequency Stability: ±30ppm; Equivalent Series Resistance(ESR): 80Ω; Operating Temperature: -20℃~+70℃

## Nets
+5V: C1.2 C2.2 C17.1 C31.2 H7.1 H7.2 LDO1.1(VIN) LDO1.3(CE) U5.5(V+) U17.1(VIN) USB1.A9(VBUS) USB1.B9(VBUS)
+5V-SWITCH: C19.1 C33.1 R20.2 R59.1 U6.6(VCC) U17.6(VOUT)
GND: C1.1 C2.1 C3.1 C4.1 C5.1 C6.1 C7.1 C8.1 C10.2 C11.1 C12.1 C21.1 C22.2 C23.1 C24.2 C25.1 C27.1 C28.1 C29.1 C30.2 C35.2 C36.2 H1.5 H1.6 H2.1 H8.1 H8.2 H9.1 H9.2 LDO1.2(VSS) R1.2 R2.2 R7.1 R10.2 R39.2 R40.2 R54.2 R58.1 R60.1 SW1.2 SW2.C SW2.D SW2.EH SW3.C SW3.D SW3.EH SW4.2 U2.8(VSSA) U2.23(VSS_1) U2.35(VSS_2) U2.47(VSS_3) U3.4 U8.4(AGND) U8.7(SYNC#/A0) U12.4(AGND) U18.11(VCC-) USB1.1 USB1.2 USB1.3 USB1.4 USB1.A12(GND) USB1.B12(GND)
PGND: C13.1 C14.1 C15.2 C16.2 C17.2 C18.1 C19.2 C20.1 C26.2 C31.1 C32.2 C33.2 C34.2 D1.2(A) Q2.3(E) R17.1 R26.2 R35.1 R45.2 R58.2 U1.4(A1) U1.5(A0) U1.6(GND) U1.11(GND) U4.4(GND) U5.2(GND) U5.4(IN-) U6.4(GND) U17.2(GND)
VBAT: U2.1(VBAT)
VCC: C3.2 C4.2 C5.2 C6.2 C7.2 C8.2 C13.2 C21.2 C28.2 H1.1 H1.2 H2.2 LDO1.5(VOUT) LED1.2(A) R6.1 R8.2 R14.1 R27.2 R29.1 R31.2 R33.1 R41.1 R42.1 R55.2 R56.1 R57.2 U1.10(VS) U2.9(VDDA) U2.24(VDD_1) U2.36(VDD_2) U2.48(VDD_3) U3.1 U8.1(VDD) U8.5(SPI2C) U12.1(VDD) U12.5(SPI2C) U12.7(SYNC#/A0)
BOOT0: R5.1 U2.44(BOOT0)
BOOT1: R4.2 U2.20(PB2)
DAC-IOUT: R24.1 U12.2(VOUT)
DAC-VOUT: R51.1 U8.2(VOUT)
DAC-VOUT1: R23.1 R52.2 U18.7(OUT2)
I-FB: H5.1 H5.2 R17.2 R18.1 R22.1 R23.2 U4.5(COMP)
I-VOUT: R25.1 U5.1(OUT)
IN-: C14.2 U1.12(VBUS) U1.14(IN-) U1.15(IN-) U1.16(IN-) U13.1
OSCIN: C11.2 U2.5(PD0-OSC_IN) X1.2
OSCOUT: C12.2 U2.6(PD1-OSC_OUT) X1.1
PA0: H3.1 U2.10(PA0-WKUP)
PA1: H3.2 U2.11(PA1)
PA2: H3.3 U2.12(PA2)
PA3: H3.4 U2.13(PA3)
PA4: H3.5 U2.14(PA4)
PA5: H3.6 U2.15(PA5)
PA6: H3.7 U2.16(PA6)
PA7: H3.8 U2.17(PA7)
PA8: C22.1 R28.1 U2.29(PA8)
PA9: C23.2 R30.1 U2.30(PA9)
PA10: LED2.2(A) U2.31(PA10)
PA11: LED3.2(A) U2.32(PA11)
PA12: U2.33(PA12)
PA15: U2.38(PA15)
PB0: U2.18(PB0)
PB1: U2.19(PB1)
PB3: U2.39(PB3)
PB4: H2.3 U2.40(PB4)
PB5: H2.4 U2.41(PB5)
PB6: C24.1 R32.1 U2.42(PB6)
PB7: C25.2 R34.1 U2.43(PB7)
PB8: C30.1 R57.1 SW4.1 U2.45(PB8)
PB9: LED4.2(A) U2.46(PB9) U17.3(EN/UVLO)
PB10: R43.2 U2.21(PB10)
PB11: R44.2 U2.22(PB11)
PB12: U2.25(PB12)
PB13: U2.26(PB13)
PB14: U2.27(PB14)
PB15: U2.28(PB15)
PC13: U2.2(PC13-TAMPER-RTC)
PC14: R61.1 U2.3(PC14-OSC32_IN)
PC15: R62.1 U2.4(PC15-OSC32_OUT)
QOD: R59.2 U17.5(QOD)
RESET: C10.1 R8.1 SW1.1 U2.7(NRST)
RS+: R26.1 U5.3(IN+) U13.2
SCL2: R41.2 R43.1 U1.9(SCL) U8.6(SCLK/SCL) U12.6(SCLK/SCL)
SDA2: R42.2 R44.1 U1.8(SDA) U8.8(SDIN/SDA) U12.8(SDIN/SDA)
STEP-DOWN1: Q1.2(C) R15.2 U4.1(SWC) U4.7(IPK) U4.8(DRC)
SWCLK: R7.2 U2.37(PA14) U3.3
SWDIO: R6.2 U2.34(PA13) U3.2
V-UP: C15.1 C26.1 D3.1(K) H4.1 H4.2 R15.1 R36.2 U4.6(VCC) U18.4(VCC+)
VOUT: C16.1 H6.1 H6.2 L1.1 L3.1 R18.2
VOUT-FILTER: C34.1 L3.2 U1.1(IN+) U1.2(IN+) U1.3(IN+)
$1N3381: R1.1 USB1.A5(CC1)
$1N3384: R10.1 USB1.B5(CC2)
$1N3407: LED1.1(C) R2.1
$1N3468: H1.4 R4.1
$1N3483: H1.3 R5.2
$1N3763: R14.2 U1.7(ALERT)
$1N5169: D1.1(K) L1.2 Q1.3(E) R37.1
$1N12640: R21.1 U6.8(DRC)
$1N14143: C20.2 U4.3(TCAP)
$1N14411: D2.1(A) R53.2 U18.1(OUT1)
$1N14439: D2.2(K) R22.2
$1N14584: R25.2 U18.3(IN1+)
$1N14642: R24.2 R53.1 U18.2(IN1-)
$1N15295: Q2.1(B) R45.1 U6.2(SWE)
$1N15305: C18.2 U6.3(TCAP)
$1N19205: R29.2 R30.2 SW2.B
$1N19210: R27.1 R28.2 SW2.A
$1N19642: R33.2 R34.2 SW3.B
$1N19652: R31.1 R32.2 SW3.A
$1N21463: L2.2 R20.1 R21.2 U6.7(IPK)
$1N21716: R35.2 R36.3 U6.5(COMP)
$1N21810: C27.2 U8.10(VREFIO)
$1N23905: C29.2 U12.10(VREFIO)
$1N26107: Q1.1(B) R37.2 U4.2(SWE)
$1N26297: D3.2(A) L2.1 Q2.2(C) U6.1(SWC)
$1N36216: LED2.1(C) R39.1
$1N36298: LED3.1(C) R40.1
$1N65373: R51.2 U18.5(IN2+)
$1N65377: R52.1 R60.2 U18.6(IN2-)
$1N72576: LED4.1(C) R54.1
$1N76167: C35.1 R55.1 R61.2 SW2.E
$1N76238: C36.1 R56.2 R62.2 SW3.E
$1N76827: C32.1 U17.4(CT)

Not connected (* = marked no-connect by the designer): LDO1 4(NC)*; R18 3; R36 1; U1 13(NC)*; U8 3(NC)* 9(NC)*; U12 3(NC)* 9(NC)*

## Notes on the sheet
- BOOT电路
- 滤波电路
- 点灯大师
- 接线端子
- 电源（type-c接口）
- 矩阵键盘排针
- OLED屏幕
- 电路采样电阻
- 下载调试电路
- RESET电路
- 外部高速时钟
- EC11旋转编码器
- 电流测量(流入方向)
- 电流测量(流出方向)
- A0=0 A1=0 Slave从机地址设置 0x40 (7bit)
- 电压测量(0-36V)
- 接stm32的2号I2C的SDA
- 采样电流放大
- A0=0 Slave从机地址设置 0x48 (7bit)
- DAC-VOUT范围：0-2.5V
- MCU
- 接stm32的2号I2C的SCL
- 去耦旁路电容
- 上拉电阻
- 电压电流测量
- A0=1 Slave从机地址设置 0x49 (7bit)
- 电流反馈
- DAC-IOUT范围：0-2.5V
- DAC
- V-DAC输出隔离
- Step-Down降压
- ON/OFF 开关
- 测试引脚
- Step-UP升压
